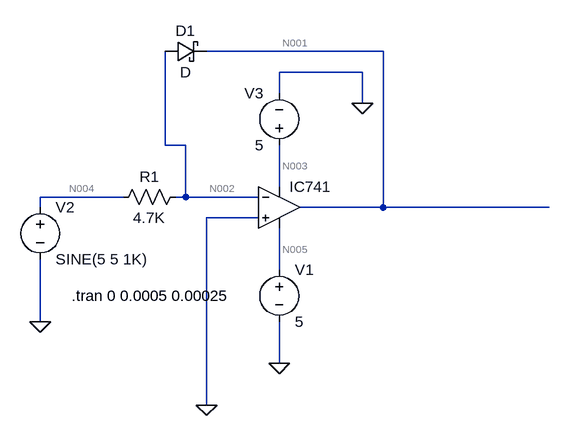
[diagram p0: schematic log circuit.asc]
log circuit.asc, the LTspice schematic file:
Version 4
SHEET 1 880 680
WIRE 384 -80 112 -80
WIRE 352 -48 224 -48
WIRE 224 -16 224 -48
WIRE 352 0 352 -48
WIRE 48 64 48 -80
WIRE 80 64 48 64
WIRE 224 128 224 64
WIRE -16 144 -144 144
WIRE 80 144 80 64
WIRE 80 144 64 144
WIRE 192 144 80 144
WIRE -144 160 -144 144
WIRE 384 160 384 -80
WIRE 384 160 256 160
WIRE 640 160 384 160
WIRE 192 176 112 176
WIRE 224 256 224 192
WIRE -144 336 -144 240
WIRE 224 400 224 336
WIRE 112 464 112 176
FLAG -144 336 0
FLAG 112 464 0
FLAG 224 400 0
FLAG 352 0 0
SYMBOL OpAmps\\UniversalOpamp2 224 160 R0
SYMATTR InstName IC741
SYMBOL voltage 224 240 R0
WINDOW 123 0 0 Left 0
WINDOW 39 0 0 Left 0
SYMATTR InstName V1
SYMATTR Value 5
SYMBOL voltage -144 144 R0
WINDOW 123 0 0 Left 0
WINDOW 39 0 0 Left 0
SYMATTR InstName V2
SYMATTR Value SINE(5 5 1K)
SYMBOL voltage 224 80 R180
WINDOW 0 24 96 Left 2
WINDOW 3 24 16 Left 2
WINDOW 123 0 0 Left 0
WINDOW 39 0 0 Left 0
SYMATTR InstName V3
SYMATTR Value 5
SYMBOL res 80 128 R90
WINDOW 0 0 56 VBottom 2
WINDOW 3 32 56 VTop 2
SYMATTR InstName R1
SYMATTR Value 4.7K
SYMBOL schottky 48 -64 R270
WINDOW 0 32 32 VTop 2
WINDOW 3 0 32 VBottom 2
SYMATTR InstName D1
TEXT -96 296 Left 2 !.tran 0 0.0005 0.00025

The netlist it stands for:
* log circuit.asc
XIC741 0 N002 N003 N005 N001 level.2 Avol=1Meg GBW=10Meg Slew=10Meg ilimit=25m rail=0 Vos=0 phimargin=45 en=0 enk=0 in=0 ink=0 Rin=500Meg  ; pins IN+ IN- V+ V- OUT
V1 N005 0 5
V2 N004 0 SINE(5 5 1K)
V3 N003 0 5
R1 N002 N004 4.7K
D1 N002 N001 D
.model D D
.lib standard.dio
.tran 0 0.0005 0.00025
.lib UniversalOpamps2.sub
.backanno
.end

* Results of the author's LTspice run, read from the files saved beside the schematic
* Operating Point, zero values left out:
*   V(n001) = 5 V
*   V(n003) = 5 V
*   V(n005) = 5 V
*   V(n002) = 5 V
*   V(n004) = 5 V
*   I(V3) = -30 nA
*   I(V1) = -30 nA
*   Ix(ic741:1) = -10 nA
*   Ix(ic741:3) = 30 nA
*   Ix(ic741:4) = 30 nA
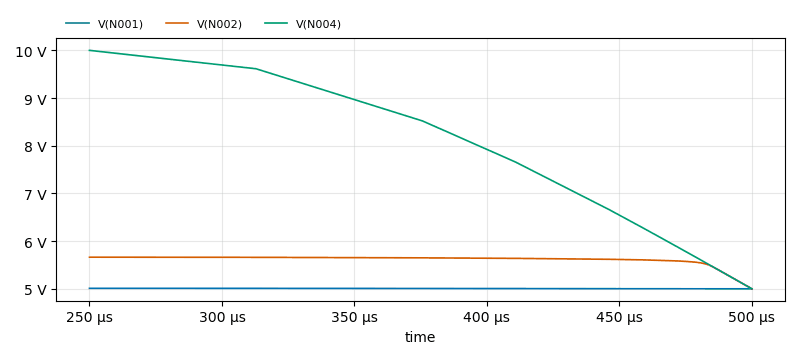
[diagram p1: Transient Analysis of log circuit.asc, plotted from the saved traces]
* Transient Analysis, 1 run:
*   V(N001): min 5 V, max 5.01 V, average 5.006 V, rms 5.006 V, last 5 V
*   V(N002): min 5 V, max 5.663 V, average 5.615 V, rms 5.616 V, last 5 V
*   V(N004): min 5 V, max 10 V, average 8.15 V, rms 8.296 V, last 5 V